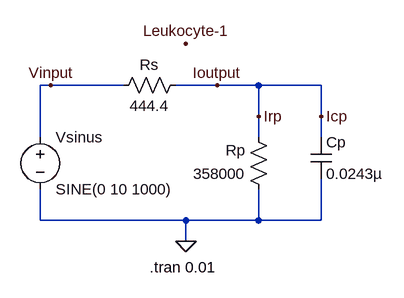
[diagram p0: schematic Leukocyte-1.asc]
Leukocyte-1.asc, the LTspice schematic file:
Version 4
SHEET 1 880 680
WIRE -32 80 -48 80
WIRE 80 80 -32 80
WIRE 224 80 160 80
WIRE 288 80 224 80
WIRE 384 80 288 80
WIRE 288 128 288 80
WIRE 384 128 384 80
WIRE -48 160 -48 80
WIRE 288 160 288 128
WIRE 384 160 384 128
WIRE -48 288 -48 240
WIRE 176 288 -48 288
WIRE 288 288 288 240
WIRE 288 288 176 288
WIRE 384 288 384 224
WIRE 384 288 288 288
WIRE 176 320 176 288
FLAG 176 320 0
FLAG -32 80 Vinput
FLAG 288 128 Irp
FLAG 384 128 Icp
FLAG 224 80 Ioutput
FLAG 176 16 Leukocyte-1
SYMBOL res 176 64 R90
WINDOW 0 0 56 VBottom 2
WINDOW 3 32 56 VTop 2
SYMATTR InstName Rs
SYMATTR Value 444.4
SYMBOL res 304 256 R180
WINDOW 0 36 76 Left 2
WINDOW 3 36 40 Left 2
SYMATTR InstName Rp
SYMATTR Value 358000
SYMBOL cap 368 160 R0
SYMATTR InstName Cp
SYMATTR Value 0.0243µ
SYMBOL voltage -48 144 R0
WINDOW 123 0 0 Left 0
WINDOW 39 0 0 Left 0
SYMATTR InstName Vsinus
SYMATTR Value SINE(0 10 1000)
TEXT 120 360 Left 2 !.tran 0.01

The netlist it stands for:
* Leukocyte-1.asc
Rs Ioutput Vinput 444.4
Rp 0 Ioutput 358000
Cp Ioutput 0 0.0243µ
Vsinus Vinput 0 SINE(0 10 1000)
.tran 0.01
.backanno
.end